# Altium schematic sheet LEDs.SchDoc
size A; SheetNumber: 1; SheetTotal: 6
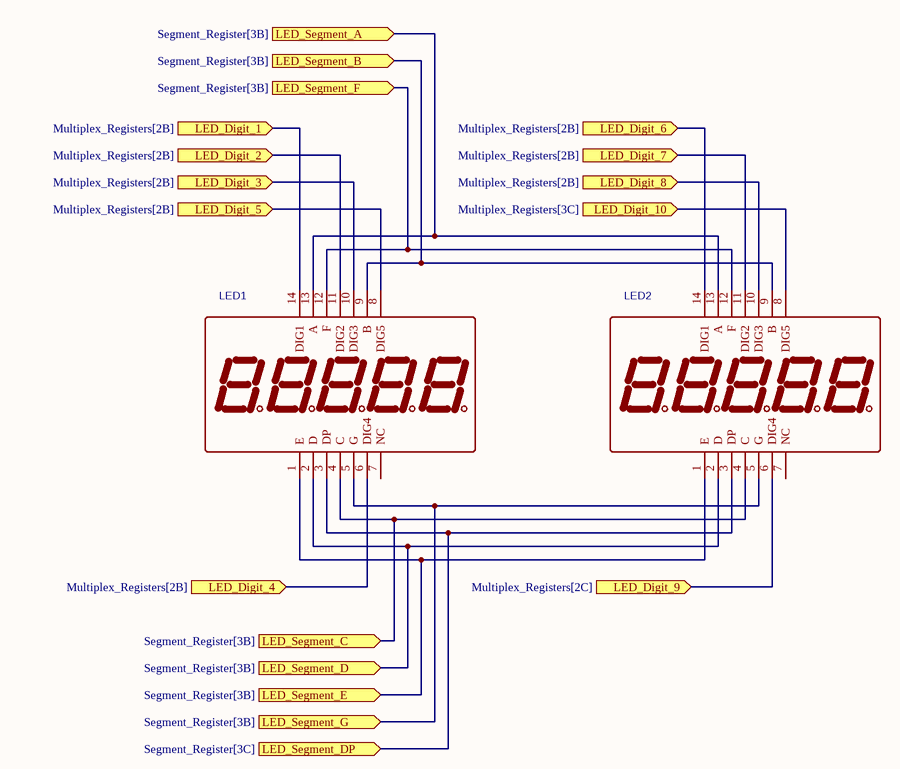
[diagram p0: LEDs.SchDoc]

## Parts
LED1  SLR0365CRA1BD/AFN-3651A  [LED-SEG-TH_SLR0365CRA1BD-AFN-3651A]  (value not drawn)
LED2  SLR0365CRA1BD/AFN-3651A  [LED-SEG-TH_SLR0365CRA1BD-AFN-3651A]  (value not drawn)

## Ports
LED_Digit_1 (in, see Multiplex_Registers[2B]), LED_Digit_2 (in, see Multiplex_Registers[2B]), LED_Digit_3 (in, see Multiplex_Registers[2B]), LED_Digit_4 (in, see Multiplex_Registers[2B]), LED_Digit_5 (in, see Multiplex_Registers[2B]), LED_Digit_6 (in, see Multiplex_Registers[2B]), LED_Digit_7 (in, see Multiplex_Registers[2B]), LED_Digit_8 (in, see Multiplex_Registers[2B]), LED_Digit_9 (in, see Multiplex_Registers[2C]), LED_Digit_10 (in, see Multiplex_Registers[3C]), LED_Segment_A (in, see Segment_Register[3B]), LED_Segment_B (in, see Segment_Register[3B]), LED_Segment_C (in, see Segment_Register[3B]), LED_Segment_D (in, see Segment_Register[3B]), LED_Segment_DP (in, see Segment_Register[3C]), LED_Segment_E (in, see Segment_Register[3B]), LED_Segment_F (in, see Segment_Register[3B]), LED_Segment_G (in, see Segment_Register[3B])

## Nets
LED_Digit_1: LED1.14(DIG1) ; port LED_Digit_1
LED_Digit_2: LED1.11(DIG2) ; port LED_Digit_2
LED_Digit_3: LED1.10(DIG3) ; port LED_Digit_3
LED_Digit_4: LED1.6(DIG4) ; port LED_Digit_4
LED_Digit_5: LED1.8(DIG5) ; port LED_Digit_5
LED_Digit_6: LED2.14(DIG1) ; port LED_Digit_6
LED_Digit_7: LED2.11(DIG2) ; port LED_Digit_7
LED_Digit_8: LED2.10(DIG3) ; port LED_Digit_8
LED_Digit_9: LED2.6(DIG4) ; port LED_Digit_9
LED_Digit_10: LED2.8(DIG5) ; port LED_Digit_10
LED_Segment_A: LED1.13(A) LED2.13(A) ; port LED_Segment_A
LED_Segment_B: LED1.9(B) LED2.9(B) ; port LED_Segment_B
LED_Segment_C: LED1.4(C) LED2.4(C) ; port LED_Segment_C
LED_Segment_D: LED1.2(D) LED2.2(D) ; port LED_Segment_D
LED_Segment_DP: LED1.3(DP) LED2.3(DP) ; port LED_Segment_DP
LED_Segment_E: LED1.1(E) LED2.1(E) ; port LED_Segment_E
LED_Segment_F: LED1.12(F) LED2.12(F) ; port LED_Segment_F
LED_Segment_G: LED1.5(G) LED2.5(G) ; port LED_Segment_G

Not connected (* = marked no-connect by the designer): LED1 7(NC); LED2 7(NC)

## Library data of the parts
LED1 LED2 = SLR0365CRA1BD/AFN-3651A: BOM_Manufacturer: SUNLIGHT; Contributor: LCSC; BOM_Supplier: LCSC; BOM_Supplier Part: C225969; BOM_Manufacturer Part: SLR0365CRA1BD/AFN-3651A; BOM_JLCPCB Part Class: Extended Part; spicePre: L; spiceSymbolName: SLR0365CRA1BD/AFN-3651A